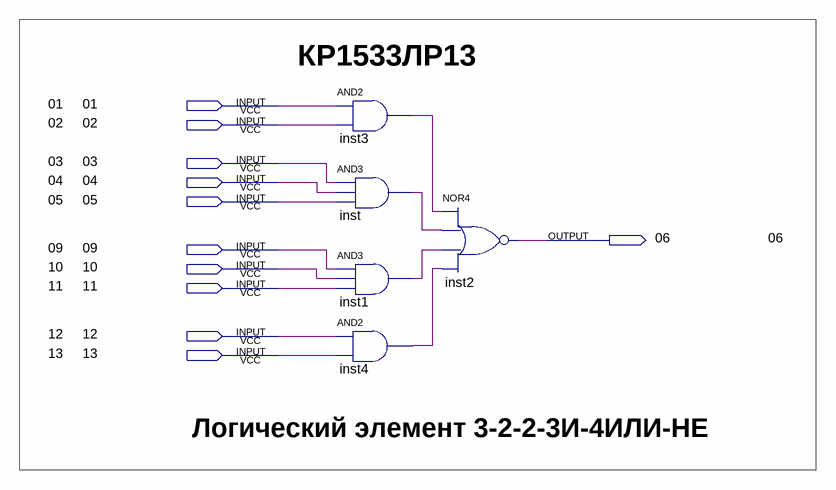
[diagram p0: schematic sheet]
// Quartus schematic KP1533LR13.bdf as structural Verilog: 5 symbols, 11 pins
module KP1533LR13 (
  input  \01 ,
  input  \02 ,
  input  \03 ,
  input  \04 ,
  input  \05 ,
  input  \09 ,
  input  \10 ,
  input  \11 ,
  input  \12 ,
  input  \13 ,
  output \06 
);

  wire inst1_out, inst3_out, inst4_out, inst_out;

  and inst3 (inst3_out, \01 , \02 );
  and inst (inst_out, \03 , \04 , \05 );
  and inst1 (inst1_out, \09 , \10 , \11 );
  and inst4 (inst4_out, \12 , \13 );
  nor inst2 (\06 , inst3_out, inst_out, inst1_out, inst4_out);

  // Notes on the sheet:
  //   КР1533ЛР13
  //   01
  //   02
  //   03
  //   04
  //   05
  //   06
  //   09
  //   10
  //   11
  //   12
  //   13
  //   Логический элемент 3-2-2-3И-4ИЛИ-НЕ
endmodule
